# EAGLE design charger_v4 (EAGLE 9.6.1)
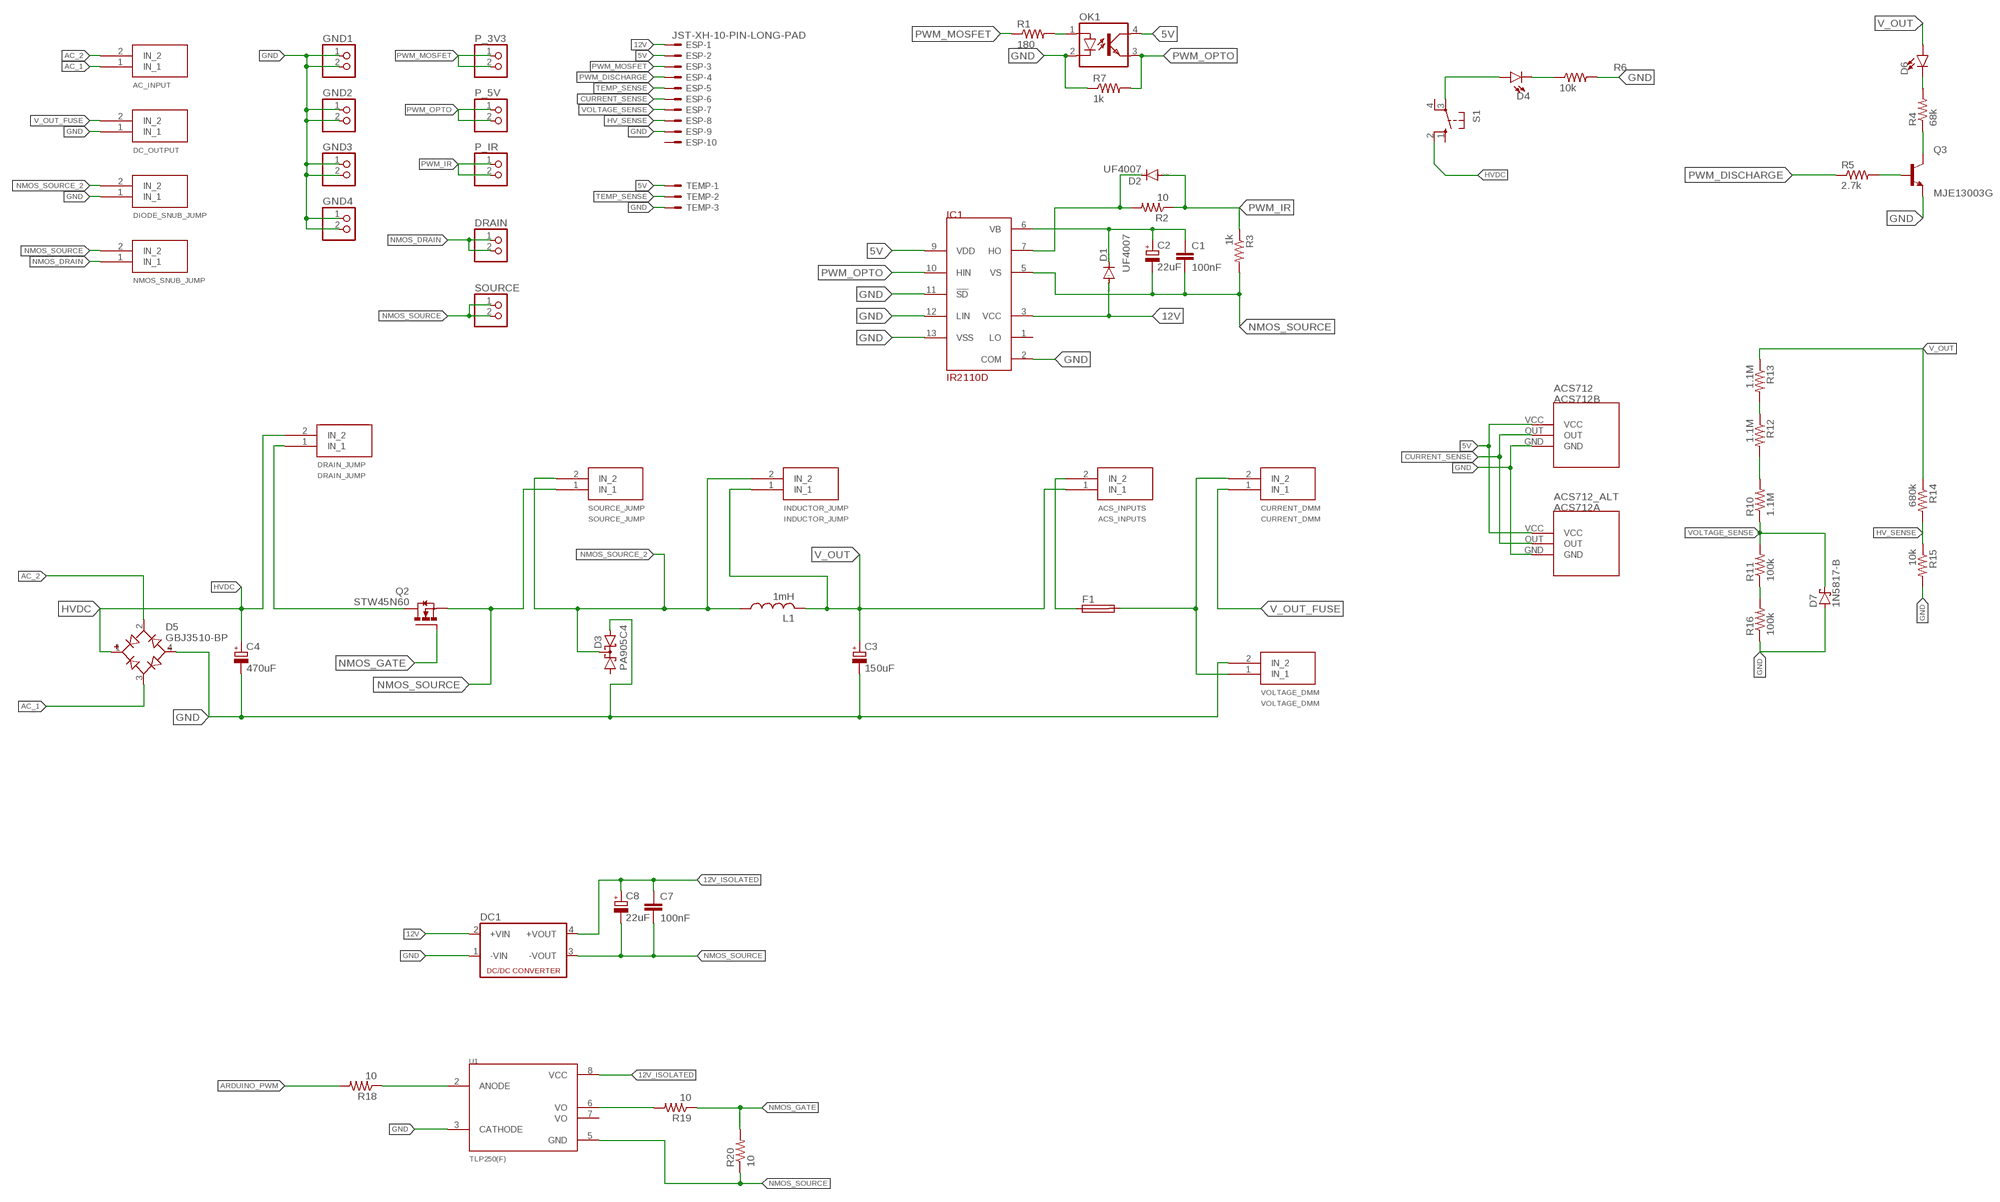
[diagram p0: schematic, sheet 1]

## Parts
AC_INPUT  AC_INPUT  TERMINAL_2P  [TERMINAL_2P]
ACS712  ACS712B  [ACS712-2]
ACS712_ALT  ACS712A  [ACS712-1]
ACS_INPUTS  ACS_INPUTS  TERMINAL_2P  [TERMINAL_2P]
C1  100nF  C-EU025-025X050  [C025-025X050]
C2  22uF  CPOL-EUE2,5-6E  [E2,5-6E]
C3  150uF  CPOL-EUE7.5-18  [E7,5-18]
C4  470uF  CPOL-EUE10-35  [EB35D]
C7  100nF  C-EU025-025X050  [C025-025X050]
C8  22uF  CPOL-EUE2,5-6E  [E2,5-6E]
CURRENT_DMM  CURRENT_DMM  TERMINAL_2P  [TERMINAL_2P]
D1  UF4007  BAS15  [DO34-7]
D2  UF4007  BAS15  [DO34-7]
D3  PA905C4  PBYR3035  [SOT93S]
D4  LED5MM  [LED_5MM]
D5  GBJ3510-BP  [DIOB_GBJ3510-BP]
D6  LED5MM  [LED_5MM]
D7  1N5817-B  [DO41-7.6]
DC1  NME  [NME]
DC_OUTPUT  DC_OUTPUT  TERMINAL_2P  [TERMINAL_2P]
DIODE_SNUB_JUMP  DIODE_SNUB_JUMP  TERMINAL_2P  [TERMINAL_2P]
DRAIN  PINHD-1X2  [1X02]
DRAIN_JUMP  DRAIN_JUMP  TERMINAL_2P  [TERMINAL_2P]
ESP  JST-XH-10-PIN-LONG-PAD  [JST-XH-10-PACKAGE-LONG-PAD]
F1  FUSEHOLDER  [FUSEHOLDER]
GND1  PINHD-1X2  [1X02]
GND2  PINHD-1X2  [1X02]
GND3  PINHD-1X2  [1X02]
GND4  PINHD-1X2  [1X02]
IC1  IR2110D  [DIL14]
INDUCTOR_JUMP  INDUCTOR_JUMP  TERMINAL_2P  [TERMINAL_2P]
L1  1mH  L-USTJ7-U1  [TJ7-U1]
NMOS_SNUB_JUMP  NMOS_SNUB_JUMP  TERMINAL_2P  [TERMINAL_2P]
OK1  SFH618A-5  [DIP4]
P_3V3  PINHD-1X2  [1X02]
P_5V  PINHD-1X2  [1X02]
P_IR  PINHD-1X2  [1X02]
Q2  STW45N60  IRFP240  [TO247AC]
Q3  MJE13003G  [TO229P780X300X1364-3]
R1  180  R-US_0204/7  [0204/7]
R2  10  R-US_0204/7  [0204/7]
R3  1k  R-US_0204/7  [0204/7]
R4  68k  R-US_0411/15  [0411/15]
R5  2.7k  R-US_0204/7  [0204/7]
R6  10k  R-US_0204/7  [0204/7]
R7  1k  R-US_0204/7  [0204/7]
R10  1.1M  R-US_R0805  [R0805]
R11  100k  R-US_R0805  [R0805]
R12  1.1M  R-US_R0805  [R0805]
R13  1.1M  R-US_R0805  [R0805]
R14  680k  R-US_0207/10  [0207/10]
R15  10k  R-US_0207/10  [0207/10]
R16  100k  R-US_R0805  [R0805]
R18  10  R-US_0204/7  [0204/7]
R19  10  R-US_0204/7  [0204/7]
R20  10  R-US_0204/7  [0204/7]
S1  10-XX  [B3F-10XX]
SOURCE  PINHD-1X2  [1X02]
SOURCE_JUMP  SOURCE_JUMP  TERMINAL_2P  [TERMINAL_2P]
TEMP  JST-XH-03-PIN-LONG-PAD  [JST-XH-03-PACKAGE-LONG-PAD]
U1  TLP250(F)  [DIP1016W50P254L966H380Q8P]
VOLTAGE_DMM  VOLTAGE_DMM  TERMINAL_2P  [TERMINAL_2P]

## Nets
5V: ACS712.VCC ACS712_ALT.VCC ESP.2 IC1.9(VDD) OK1.4(COL) TEMP.1
12V: D1.A DC1.2(+VIN) ESP.1 IC1.3(VCC)
12V_ISOLATED: C7.1 C8.+ DC1.4(+VOUT) U1.8(VCC)
AC_1: AC_INPUT.1(IN_1) D5.3(AC2)
AC_2: AC_INPUT.2(IN_2) D5.2(AC1)
ARDUINO_PWM: R18.2
CURRENT_SENSE: ACS712.OUT ACS712_ALT.OUT ESP.6
GND: ACS712.GND ACS712_ALT.GND C3.- C4.- D3.A2 D5.4(-) D7.A DC1.1(-VIN) DC_OUTPUT.1(IN_1) DIODE_SNUB_JUMP.1(IN_1) ESP.9 GND1.1 GND1.2 GND2.1 GND2.2 GND3.1 GND3.2 GND4.1 GND4.2 IC1.2(COM) IC1.11(!SD) IC1.12(LIN) IC1.13(VSS) OK1.2(C) Q3.3(E) R6.2 R7.1 R15.2 R16.1 TEMP.3 U1.3(CATHODE) VOLTAGE_DMM.2(IN_2)
HV_SENSE: ESP.8 R14.2 R15.1
HVDC: C4.+ D5.1(+) DRAIN_JUMP.2(IN_2) S1.2(S1)
N$1: D2.C IC1.7(HO) R2.2
N$2: D4.A S1.3(P)
N$3: Q3.2(C) R4.1
N$4: D6.K(C) R4.2
N$5: Q3.1(B) R5.2
N$8: D4.K(C) R6.1
N$9: OK1.1(A) R1.2
N$11: CURRENT_DMM.2(IN_2) F1.2 VOLTAGE_DMM.1(IN_1)
N$12: R10.2 R12.2
N$13: R12.1 R13.2
N$14: R11.1 R16.2
N$15: ACS_INPUTS.2(IN_2) F1.1
N$17: R18.1 U1.2(ANODE)
N$21: R19.2 U1.6(VO)
NMOS_DRAIN: DRAIN.1 DRAIN.2 DRAIN_JUMP.1(IN_1) NMOS_SNUB_JUMP.1(IN_1) Q2.2(D)
NMOS_GATE: Q2.1(G) R19.1 R20.2
NMOS_SOURCE: C1.2 C2.- C7.2 C8.- DC1.3(-VOUT) IC1.5(VS) NMOS_SNUB_JUMP.2(IN_2) Q2.3(S) R3.2 R20.1 SOURCE.1 SOURCE.2 SOURCE_JUMP.1(IN_1) U1.5(GND)
NMOS_SOURCE_2: D3.C DIODE_SNUB_JUMP.2(IN_2) INDUCTOR_JUMP.2(IN_2) L1.1 SOURCE_JUMP.2(IN_2)
PWM_DISCHARGE: ESP.4 R5.1
PWM_IR: D2.A P_IR.1 P_IR.2 R2.1 R3.1
PWM_MOSFET: ESP.3 P_3V3.1 P_3V3.2 R1.1
PWM_OPTO: IC1.10(HIN) OK1.3(EMIT) P_5V.1 P_5V.2 R7.2
TEMP_SENSE: ESP.5 TEMP.2
V_OUT: ACS_INPUTS.1(IN_1) C3.+ D6.A INDUCTOR_JUMP.1(IN_1) L1.2 R13.1 R14.1
V_OUT_FUSE: CURRENT_DMM.1(IN_1) DC_OUTPUT.2(IN_2)
VB: C1.1 C2.+ D1.C IC1.6(VB)
VOLTAGE_SENSE: D7.C ESP.7 R10.1 R11.2
Unconnected: D3.A1 ESP.10 IC1.1(LO) S1.1(S) S1.4(P1) U1.7(VO)

## Library data of the parts
AC_INPUT ACS_INPUTS CURRENT_DMM DC_OUTPUT DIODE_SNUB_JUMP DRAIN_JUMP INDUCTOR_JUMP NMOS_SNUB_JUMP SOURCE_JUMP VOLTAGE_DMM = TA_library:TERMINAL_2P
ACS712 ACS712_ALT = TA_library:ACS712
C1 C7 = rcl:C-EU: CAPACITOR, European symbol; SPICEPREFIX: C
C2-C4 C8 = rcl:CPOL-EU: POLARIZED CAPACITOR, European symbol; SPICEPREFIX: C
D1 D2 = diode:BAS15: DIODE high speed
D3 = diode:PBYR3035: Dual DIODE common cathode
D4 D6 = Sparkfun_LED:LED: LED (Generic) Standard schematic elements and footprints for 5mm, 3mm, 1206, and 0603 sized LEDs. Generic LEDs with no color specified.
D5 = GBJ3510-BP:GBJ3510-BP: Diode Rectifier Bridge Single 1KV 35A 4-Pin(4+Tab) Case GBJ Bulk/Tube Check availability <https://pricing.snapeda.com/parts/GBJ3510-BP/Micro%20Commercial/view-part?ref=eda>; AVAILABILITY: In Stock; DESCRIPTION: Bridge Rectifier Single Phase Standard 1 kV Through Hole GBJ; MF: Micro Commercial; MP: GBJ3510-BP; PACKAGE: SIP-4 Micro Commercial Co; PRICE: None; PURCHASE-URL: https://pricing.snapeda.com/search/part/GBJ3510-BP/?ref=eda
D7 = diode:1N581*: 1.0A SCHOTTKY BARRIER RECTIFIER Source: http://www.diodes.com/datasheets/ds23001.pdf
DC1 = dc-dc-converter:NME: DC-DC CONVERTER; MF: C & D TECHNOLOGIES, INC; MPN: NME1205D; OC_FARNELL: 1021466; OC_NEWARK: 98B8198
DRAIN GND1-GND4 P_3V3 P_5V P_IR SOURCE = pinhead:PINHD-1X2: PIN HEADER
ESP = Rembrandt Electronics - JST XH Connectors v1-0:JST-XH-10-PIN: JST XH Connector 2 Pin Wire to board connector. Pitch: 2,54 mm, (0.100") Number of pins: 10 Created by Rembrandt Electronics www.rembrandtelectronics.com
F1 = TA_library:FUSEHOLDER: FUSE HOLDER grid 22,5mm, isolated cap OGN0031 8201, Schurter (Buerklin); MPN: 0031.7701.11; OC_FARNELL: unknown; OC_NEWARK: 04F1224
IC1 = irs:IR2110
L1 = custom_inductor:L-US: INDUCTOR, American symbol; SPICEPREFIX: L
OK1 = optocoupler:SFH618?*: Optocoupler, Phototransistor Output, Low Input Current Source: Data sheet <http://www.vishay.com/docs/83673/sfh618.pdf>; MF: VISHAY/TELEFUNKEN; MPN: SFH618A-5; OC_FARNELL: 1469593; OC_NEWARK: 59K0259
Q2 = IRFP240(TO-247):IRFP240: MOSFET N-CH 200V 20A TO-247AC Check availability <https://pricing.snapeda.com/parts/IRFP240/Vishay%20Siliconix/view-part?ref=eda>; AVAILABILITY: In Stock; DESCRIPTION: N-Channel 200 V 20A (Tc) 150W (Tc) Through Hole TO-247AC; MF: Vishay Siliconix; MP: IRFP240; PACKAGE: TO-247 Vishay Siliconix; PRICE: None
Q3 = MJE13003G:MJE13003G: Bipolar (BJT) Transistor NPN 400V 1.5A 10MHz 1.4W Through Hole TO-225AA Check availability <https://pricing.snapeda.com/parts/MJE13003G/ON%20Semiconductor/view-part?ref=eda>; AVAILABILITY: Not in stock; DESCRIPTION: Bipolar (BJT) Transistor NPN 400 V 1.5 A 10MHz 1.4 W Through Hole TO-126; MF: ON Semiconductor; MP: MJE13003G; PACKAGE: TO-126 ON Semiconductor; PRICE: None
R1-R7 R10-R16 R18-R20 = rcl:R-US_: RESISTOR, American symbol; SPICEPREFIX: R
S1 = switch-omron:10-XX: OMRON SWITCH; MPN: B3F-1000; OC_FARNELL: 176432; OC_NEWARK: 36M3542
TEMP = JST XH Connectors v1-0:JST-XH-03-PIN: JST XH Connector 2 Pin Wire to board connector. Pitch: 2,54 mm, (0.100") Number of pins: 3 Created by Rembrandt Electronics www.rembrandtelectronics.com
U1 = TLP250_F_:TLP250(F): Optocoupler; THT; Out: IGBT driver; 2.5kV; DIP8; 1.5A Check availability <https://pricing.snapeda.com/parts/TLP250%28F%29/Toshiba/view-part?ref=eda>; AVAILABILITY: In Stock; DESCRIPTION: 1.5A Gate Driver Optical Coupling 2500Vrms 1 Channel 8-DIP; MF: Toshiba; MP: TLP250(F); PACKAGE: DIP-8 Toshiba; PRICE: None; PURCHASE-URL: https://pricing.snapeda.com/search/part/TLP250(F)/?ref=eda

## Net classes
0 default: width 0.305 mm
1 power: width 6.985 mm, clearance 0.508 mm to class 0
2 pwm_12: width 0.305 mm, clearance 0.508 mm to class 0, clearance 0.508 mm to class 1

## Board
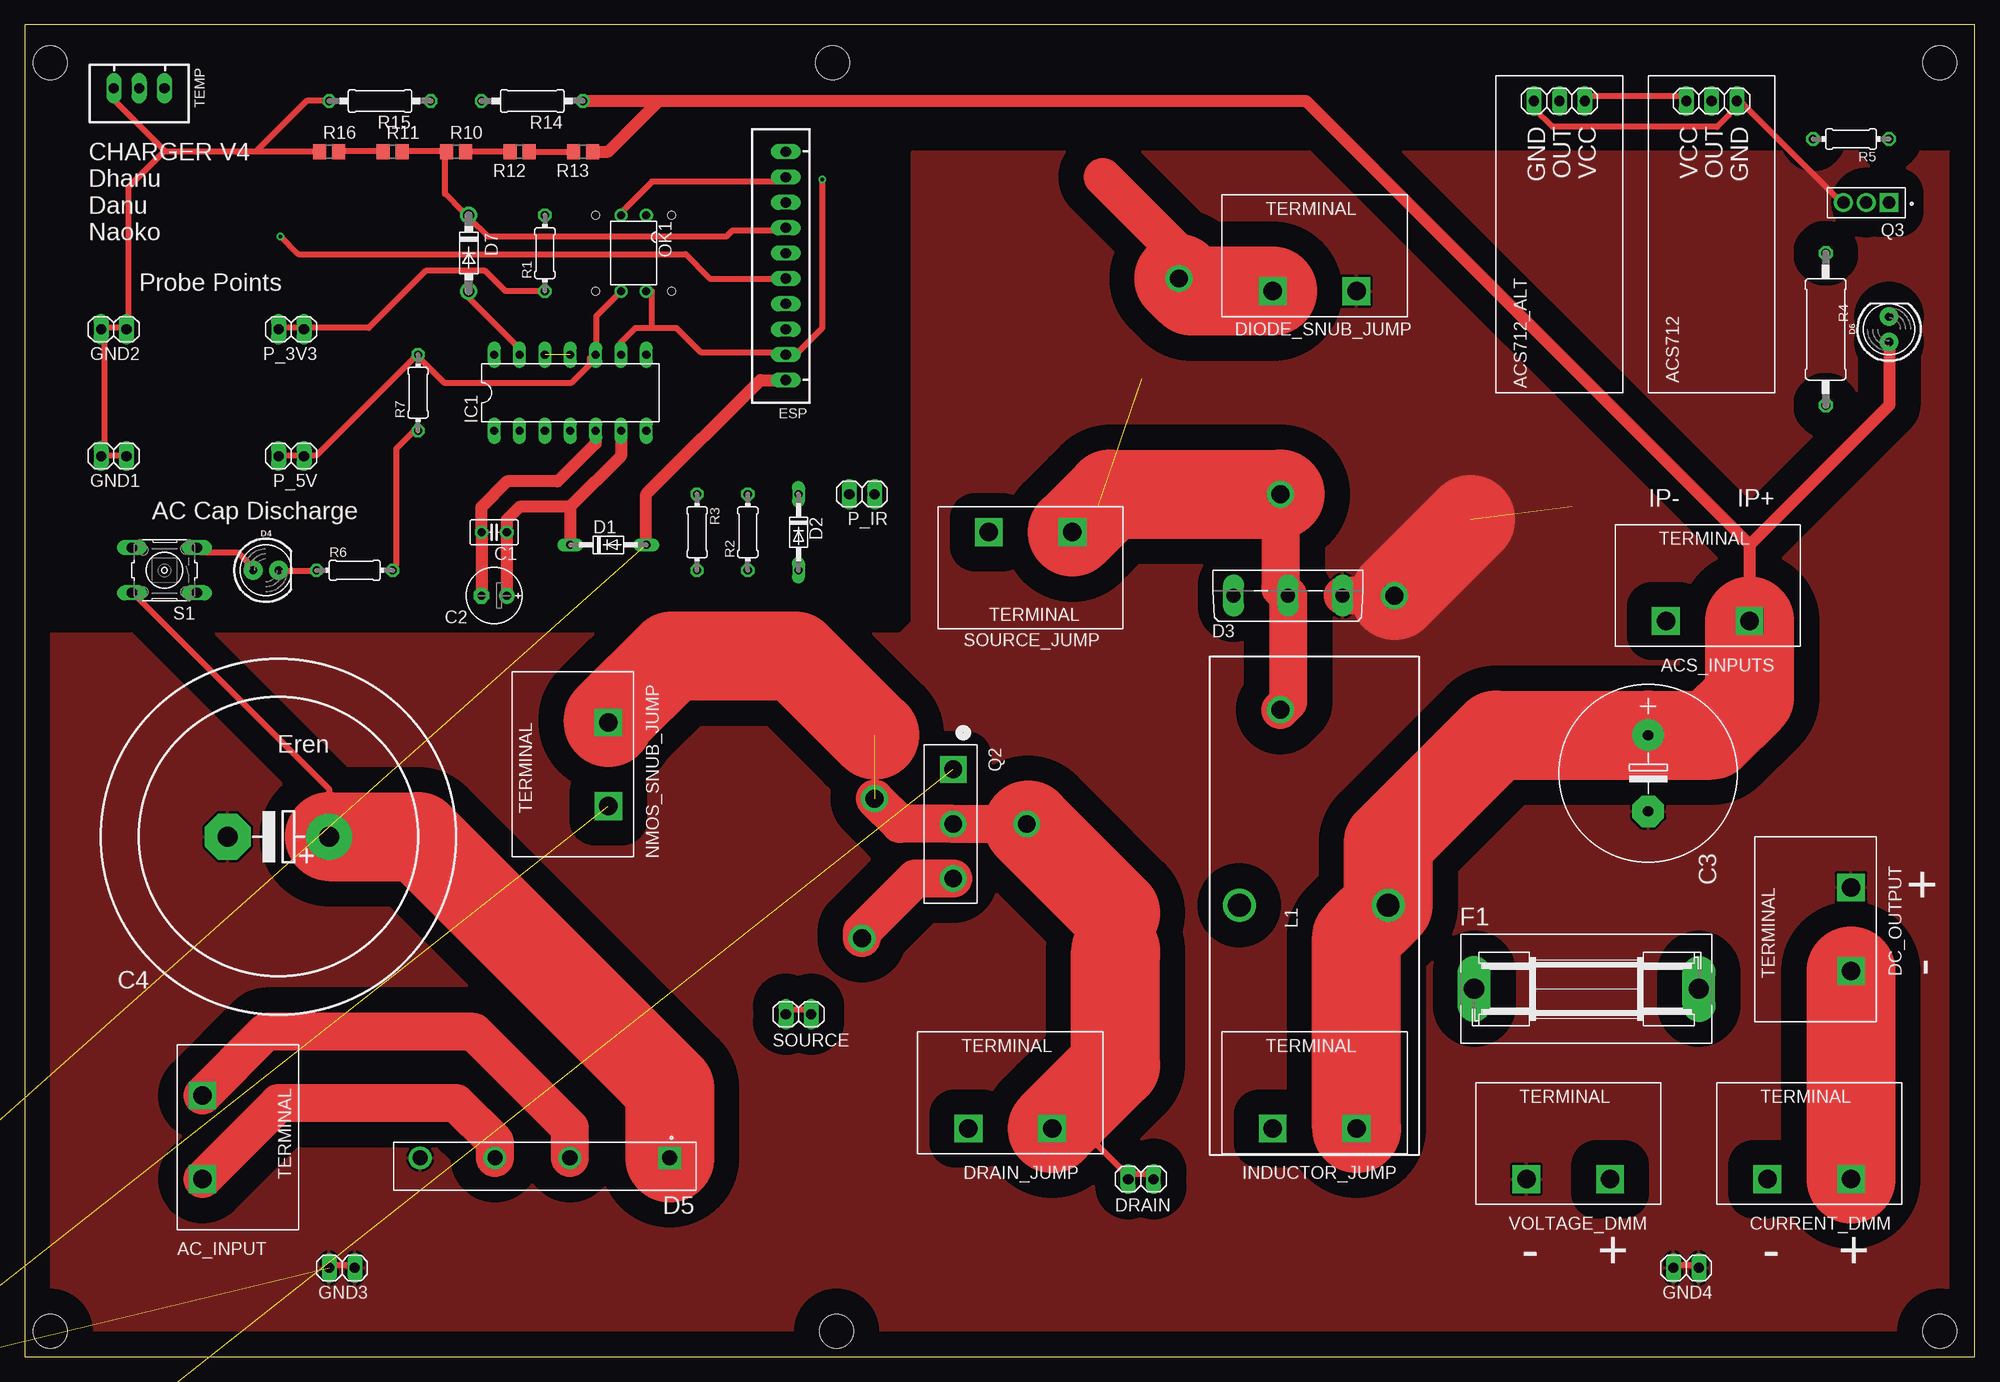
[diagram p1: board, top side]
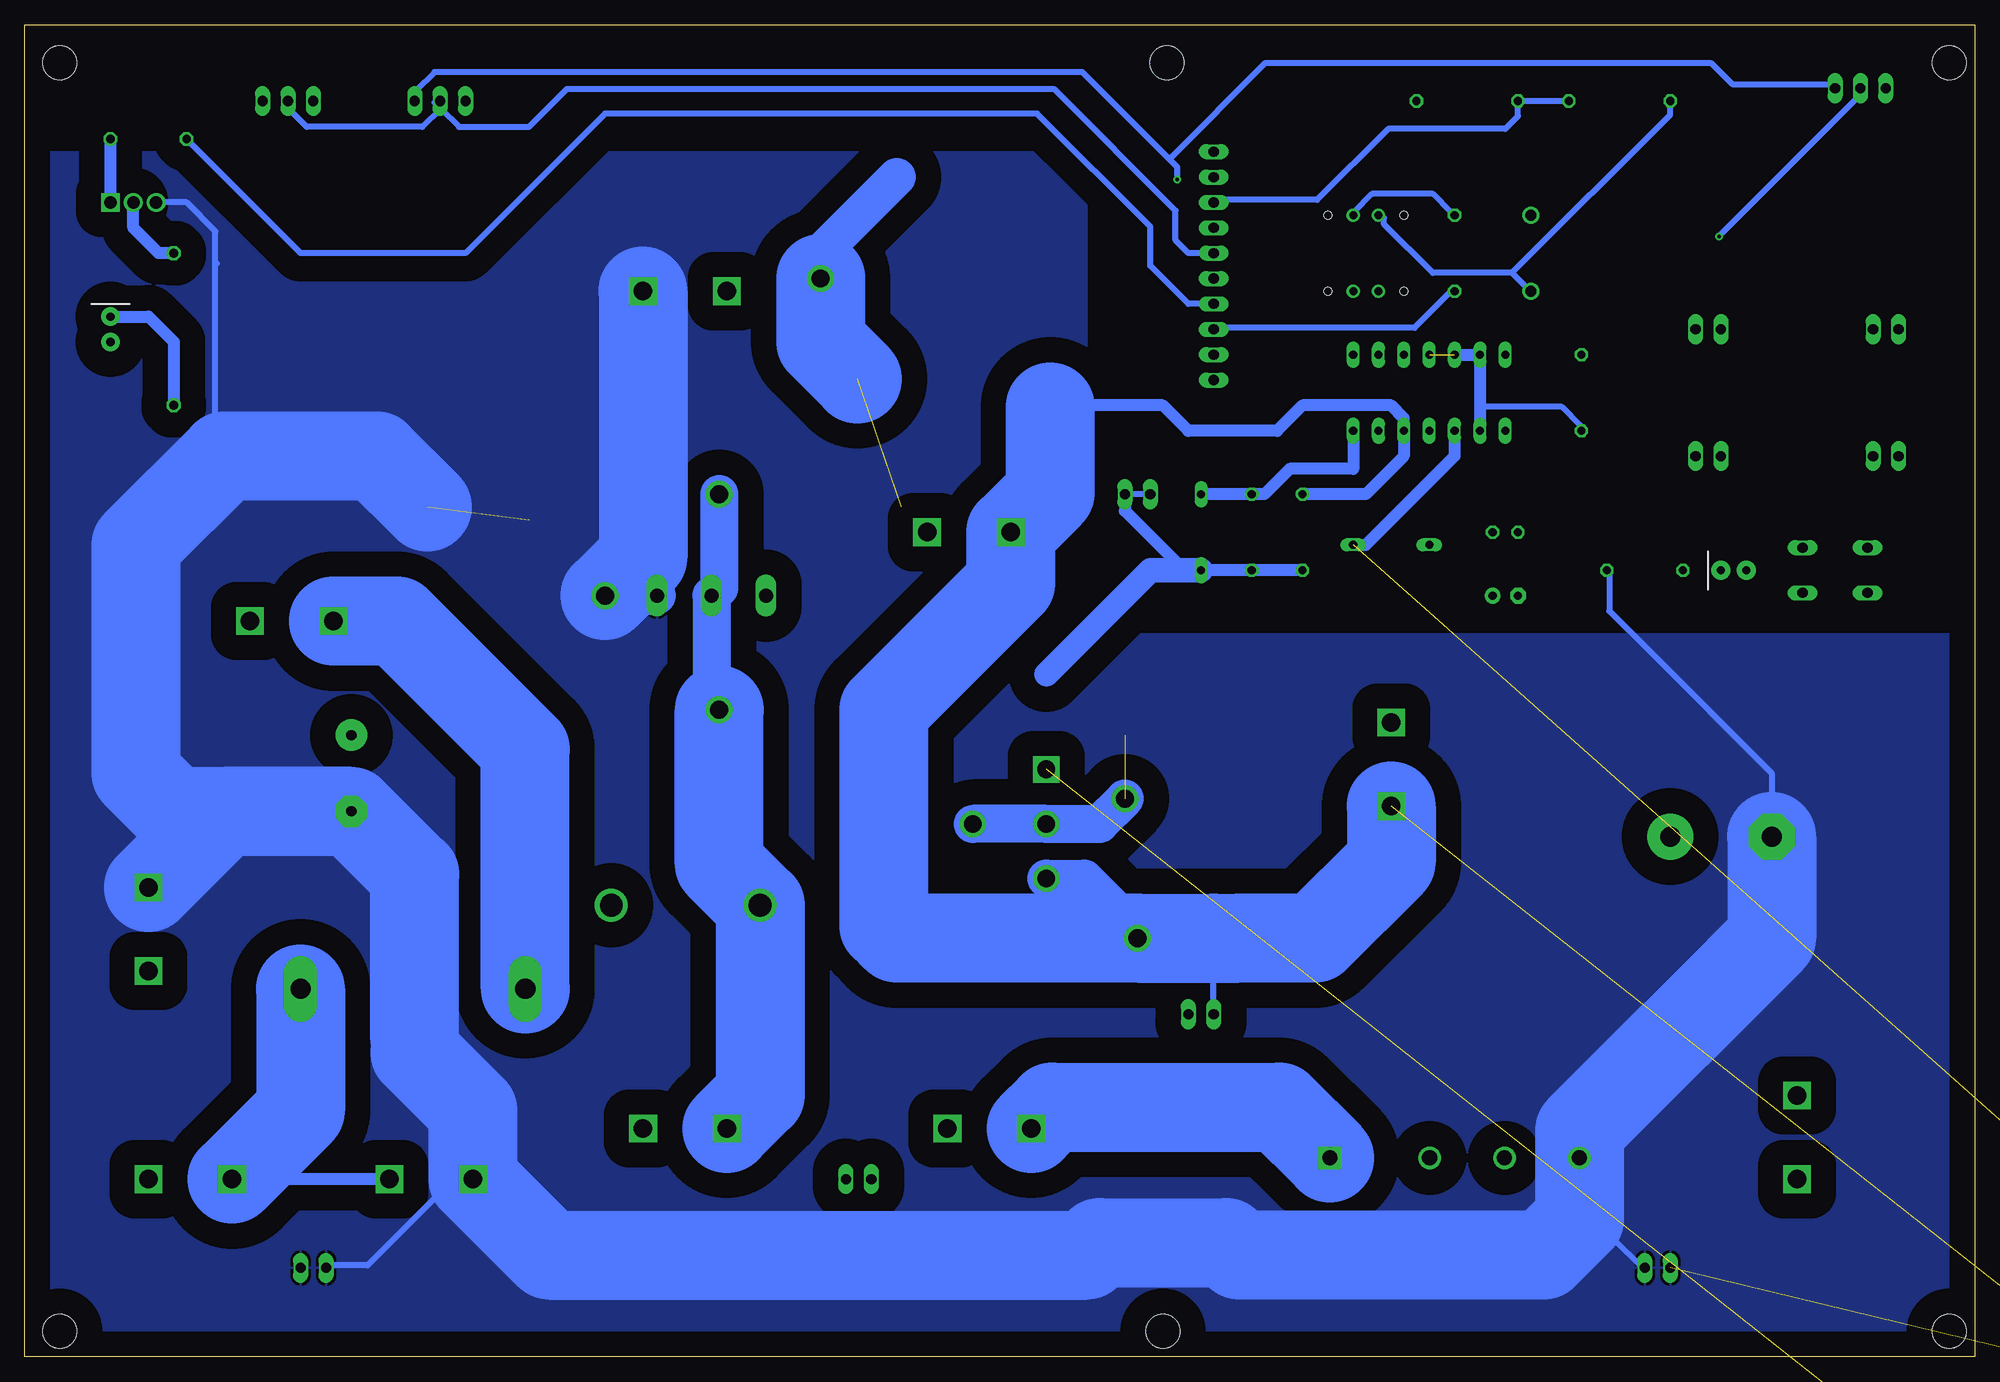
[diagram p2: board, bottom side, seen from below]

Size 195.25 x 133.34 mm. Coordinates in mm from the lower left corner, seen from the top.
Outline: 0,0 195.25,0 195.25,133.34 0,133.34 0,0
Copper layers (1*16): Top 0.035mm / dielectric 1.5mm / Bottom 0.035mm
Design rules "default *": minimum track width 24mil, minimum drill 0.35mm, track to track 24mil, track to pad 24mil, pad to pad 12mil, via to via 24mil, smd to smd 12mil, copper to edge 40mil, drill to drill 6mil, minimum pad ring 10mil, minimum via ring 8mil, stop-mask expansion 4mil, vias tented up to drill 0mil, thermal gap 10mil
Holes 3.4 mm at 2.54,129.54 81.28,2.54 2.54,2.54 80.9,129.54 191.77,2.54 191.77,129.54
Holes 0.8 mm at 57.15,114.3 57.15,106.68 64.77,114.3 64.77,106.68

### Footprints (pad centres in the part's own frame; a part is rotated, then mirrored left to right if it is on the bottom)
TERMINAL_2P = drill 1.854 square: 1 0,-3.81; 2 0,4.572
ACS712-2 = drill 1.016 long: GND -2.54,0; OUT 0,0; VCC 2.54,0
ACS712-1 = drill 1.016 long: GND 2.54,0; OUT 0,0; VCC -2.54,0
C025-025X050 = drill 0.813 octagon: 1 -1.27,0; 2 1.27,0
E2,5-6E = drill 0.813 pad 1.575: + -1.27,0 | drill 0.813 pad 1.575 octagon: - 1.27,0
E7,5-18 = drill 1.016 pad 3.15: + -3.81,0 | drill 1.016 pad 3.15 octagon: - 3.81,0
EB35D = drill 2.007 pad 4.597: + -5.08,0 | drill 2.007 pad 4.597 octagon: - 5.08,0
DO34-7 = drill 0.813 long: A 3.81,0; C -3.81,0
SOT93S = drill 1.397 long: A1 -5.461,-2.54; A2 5.461,-2.54; C 0,-2.54
LED_5MM = drill 0.813 pad 1.88: A -1.27,0; K 1.27,0
DIOB_GBJ3510-BP = drill 1.51 pad 2.27 square: 1 -12.5,-0.85 | drill 1.51 pad 2.27: 2 -2.5,-0.85; 3 5,-0.85; 4 12.5,-0.85
DO41-7.6 = drill 1.1 pad 1.7: A 3.81,0; C -3.81,0
NME = drill 0.813 long: 1 0,3.81; 2 0,1.27; 3 0,-1.27; 4 0,-3.81
1X02 = drill 1.016 long: 1 -1.27,0; 2 1.27,0
JST-XH-10-PACKAGE-LONG-PAD = drill 1.016 long: 1 -11.43,0; 2 -8.89,0; 3 -6.35,0; 4 -3.81,0; 5 -1.27,0; 6 1.27,0; 7 3.81,0; 8 6.35,0; 9 8.89,0; 10 11.43,0
FUSEHOLDER = drill 2.007 pad 3.302 long: 1 -11.252,0; 2 11.252,0
DIL14 = drill 0.813 long: 1 -7.62,-3.81; 2 -5.08,-3.81; 3 -2.54,-3.81; 4 0,-3.81; 5 2.54,-3.81; 6 5.08,-3.81; 7 7.62,-3.81; 8 7.62,3.81; 9 5.08,3.81; 10 2.54,3.81; 11 0,3.81; 12 -2.54,3.81; 13 -5.08,3.81; 14 -7.62,3.81
TJ7-U1 = drill 2.286: 1 -6.503,4.826; 2 8.408,4.826
DIP4 = drill 0.8: 1 -1.27,-3.81; 2 1.27,-3.81; 3 1.27,3.81; 4 -1.27,3.81
TO247AC = drill 1.79 pad 2.69 square: 1 -5.46,0.255 | drill 1.79 pad 2.69: 2 0,0.255; 3 5.46,0.255
TO229P780X300X1364-3 = drill 1.25 square: 1 0,0 | drill 1.25: 2 2.29,0; 3 4.58,0
0204/7 = drill 0.813 octagon: 1 -3.81,0; 2 3.81,0
0411/15 = drill 0.914 octagon: 1 -7.62,0; 2 7.62,0
R0805 = smd 1.3 x 1.5: 1 -0.95,0; 2 0.95,0
0207/10 = drill 0.813 octagon: 1 -5.08,0; 2 5.08,0
B3F-10XX = drill 1.016 long: 1 -3.251,2.261; 2 3.251,2.261; 3 -3.251,-2.261; 4 3.251,-2.261
JST-XH-03-PACKAGE-LONG-PAD = drill 1.016 long: 1 -2.54,0; 2 0,0; 3 2.54,0
DIP1016W50P254L966H380Q8P = drill 0.9 pad 1.5 square: 1 -5.08,3.81 | drill 0.9 pad 1.5: 2 -5.08,1.27; 3 -5.08,-1.27; 4 -5.08,-3.81; 5 5.08,-3.81; 6 5.08,-1.27; 7 5.08,1.27; 8 5.08,3.81

### Placement (x,y rotation side)
AC_INPUT  17.78,21.59 0 top
ACS712  168.91,125.73 180 top
ACS712_ALT  153.67,125.73 180 top
ACS_INPUTS  168.91,73.66 90 top
C1  46.99,82.55 180 top
C2  46.99,76.2 180 top
C3  162.56,58.42 270 top
C4  25.4,52.07 180 top
C7  -39.37,-21.59 0 top  (outside the outline)
C8  -39.37,-29.21 0 top  (outside the outline)
CURRENT_DMM  179.07,17.78 90 top
D1  58.42,81.28 0 top
D2  77.47,82.55 270 top
D3  126.49,78.74 0 top
D4  24.13,78.74 0 top
D5  52.07,19.05 180 top
D6  186.69,102.87 90 top
D7  44.45,110.49 270 top
DC1  -40.64,-11.43 0 top  (outside the outline)
DC_OUTPUT  182.88,43.18 180 top
DIODE_SNUB_JUMP  129.54,106.68 90 top
DRAIN  111.76,17.78 0 top
DRAIN_JUMP  99.06,22.86 90 top
ESP  76.2,109.22 90 top
F1  156.39,36.83 0 top
GND1  8.89,90.17 180 top
GND2  8.89,102.87 180 top
GND3  31.75,8.89 180 top
GND4  166.37,8.89 180 top
IC1  54.61,96.52 0 top
INDUCTOR_JUMP  129.54,22.86 90 top
L1  128.12,40.39 0 top
NMOS_SNUB_JUMP  58.42,59.69 180 top
OK1  60.96,110.49 180 top
P_3V3  26.67,102.87 180 top
P_5V  26.67,90.17 180 top
P_IR  83.82,86.36 180 top
Q2  92.71,53.34 270 top
Q3  186.69,115.57 180 top
R1  52.07,110.49 90 top
R2  72.39,82.55 90 top
R3  67.31,82.55 90 top
R4  180.34,102.87 270 top
R5  182.88,121.92 0 top
R6  33.02,78.74 0 top
R7  39.37,96.52 90 top
R10  43.18,120.65 0 top
R11  36.83,120.65 0 top
R12  49.53,120.65 180 top
R13  55.88,120.65 180 top
R14  50.8,125.73 180 top
R15  35.56,125.73 180 top
R16  30.48,120.65 0 top
R18  -29.21,-16.51 0 top  (outside the outline)
R19  -36.83,-35.56 0 top  (outside the outline)
R20  -36.83,-40.64 0 top  (outside the outline)
S1  13.97,78.74 180 top
SOURCE  77.47,34.29 180 top
SOURCE_JUMP  100.33,82.55 270 top
TEMP  11.43,127 180 top
U1  -27.94,-5.08 0 top  (outside the outline)
VOLTAGE_DMM  154.94,17.78 90 top

### Tracks (layer width: path | path; a pad name or v marks a point on that pad's centre or on a via)
5V  (via drill 0.35)
  Top 0.61: ACS712_ALT.VCC 156.67,126.19 165.81,126.19 ACS712.VCC | 62.79,103.02 62.79,106.68 OK1.4 | IC1.9 59.69,101.56 61.15,103.02 62.79,103.02 | 76.2,100.58 67.67,100.58 65.23,103.02 62.79,103.02 | v79.86,117.86 79.86,103.02 77.42,100.58 76.2,100.58 | 76.2,100.58 ESP.2
  Bottom 0.61: 80.64,119.91 89.36,128.63 154.23,128.63 156.06,126.8 156.06,126.19 ACS712_ALT.VCC | 80.64,119.91 79.86,119.13 v79.86,117.86 | 80.64,119.91 71.02,129.54 26.42,129.54 24.28,127.41 14.02,127.41 TEMP.1
12V  (1 unrouted)
  Top 1.219: D1.A 62.23,86.36 73.66,97.79 ESP.1
  Bottom 1.219: IC1.3 52.07,90.17 60.96,81.28 D1.A
12V_ISOLATED  (3 unrouted)
AC_1
  Top 3.81: D5.3 47.07,21.51 43.18,25.4 25.4,25.4 AC_INPUT.1
AC_2
  Top 3.81: AC_INPUT.2 24.13,32.51 44.96,32.51 54.57,22.9 D5.2
CURRENT_SENSE
  Bottom 0.61: 153.62,124.97 154.23,125.58 ACS712_ALT.OUT 153.62,124.97 | 153.62,124.97 151.79,123.14 144.78,123.14 140.97,126.95 92.2,126.95 80.01,114.76 80.01,111.76 78.74,110.49 ESP.6 | 153.62,124.97 155.45,123.14 167.03,123.14 168.86,124.97 168.86,125.58 ACS712.OUT
GND  (via drill 1.79)  (4 unrouted)
  Top 0.61: R15.2 28.19,125.73 23.11,120.65 R16.1 14.07,120.65 | OK1.2 59.74,114.61 62.79,117.65 76.2,117.65 ESP.9 | IC1.13 49.53,100.94 44.45,106.02 D7.A | R6.2 37.19,79.3 37.19,90.93 38.91,92.66 R7.1 | 171.91,125.58 169.47,123.14 153.01,123.14 151.18,124.97 151.18,125.58 ACS712_ALT.GND | 171.91,125.58 181.66,115.82 Q3.3 | 171.91,125.58 ACS712.GND | GND4.2 165.2,9.14 167.64,9.14 GND4.1 | GND3.2 30.48,9.14 32.92,9.14 GND3.1 | 7.92,90.22 9.75,90.22 GND1.1 | 7.92,90.22 7.92,102.41 GND2.2 7.92,103.02 9.75,103.02 GND2.1 10.36,103.02 10.36,117.09 13.92,120.65 14.07,120.65 | 7.92,90.22 GND1.2 | 14.07,120.65 9.14,125.58 9.14,126.8 TEMP.3
  Top 3.81: v137.16,76.2 D3.A2
  Top 8.89: 144.78,83.82 v137.16,76.2
  Bottom 0.61: 49.53,95.1 41.35,95.1 39.52,93.27 R7.1 | 46.33,108.51 54.25,108.51 59.13,113.39 59.13,114 OK1.2 | 46.33,108.51 44.5,106.68 D7.A | R15.2 30.48,124.36 46.33,108.51 | GND3.1 33.53,9.14 35.97,11.58 39.57,13.77 | GND4.2 164.59,9.14 160.93,9.14 154.23,15.85 VOLTAGE_DMM.2 | 176.17,109.6 176.17,94.49 175.26,90.17 | 176.17,109.6 176.01,109.47 | R6.2 36.58,78.69 36.58,74.68 20.32,58.42 C4.- 20.32,56.16 | 176.17,109.6 176.17,112.67 179.07,115.57 Q3.3
  Bottom 1.219: IC1.12 IC1.13 49.53,95.1 IC1.2 | 156.21,30.48 156.21,31.75
  Bottom 3.81: v137.16,76.2 D3.A2
  Bottom 8.89: C4.- 20.32,41.91 39.57,22.66 D5.4 39.57,13.77 43.18,10.16 73.66,10.16 74.93,11.43 87.63,11.43 88.9,10.16 142.75,10.16 VOLTAGE_DMM.2 150.37,24.64 156.21,30.48 | v137.16,76.2 133.35,80.01 DIODE_SNUB_JUMP.1 | C3.- 175.26,54.61 DC_OUTPUT.1 | C3.- 156.21,48.26 156.21,31.75 | 154.94,85.09 160.02,90.17 175.26,90.17 184.15,81.28 184.15,58.42 180.34,54.61 C3.-
  pour Top (isolate 2.54): -16.51,72.39 87.63,72.39 88.9,73.66 88.9,120.65 214.63,120.65 215.9,119.38 215.9,-8.89 -13.97,-8.89 -16.51,-6.35
  pour Bottom (isolate 2.54): -17.78,72.39 88.9,72.39 88.9,120.65 218.44,120.65 220.98,118.11 220.98,-8.89 217.17,-12.7 -21.59,-12.7 -21.59,68.58
HV_SENSE
  Bottom 0.61: R15.1 R14.2 45.72,124.21 46.99,122.94 58.73,122.94 65.84,115.82 76.2,115.82 ESP.8
HVDC
  Top 0.61: S1.2 10.79,76.48 30.48,56.79 C4.+
  Top 8.89: C4.+ 39.37,52.07 64.57,26.87 D5.1
  Bottom 8.89: D5.1 69.65,24.98 92.37,24.98 DRAIN_JUMP.2
N$1
  Bottom 1.219: D2.C R2.2 71.12,86.36 68.58,88.9 62.23,88.9 IC1.7
N$2
  Top 0.61: S1.3 17.68,80.52 21.34,80.52 22.55,79.3 D4.A
N$3
  Bottom 1.219: R4.1 181.86,110.49 184.4,113.03 Q3.2
N$4
  Bottom 1.219: D6.K 182.88,104.14 180.34,101.6 R4.2
N$5
  Bottom 1.219: R5.2 Q3.1
N$8
  Top 0.61: R6.1 28.65,78.69 25.6,78.69 D4.K
N$9
  Bottom 0.61: OK1.1 62.18,114.61 60.35,116.43 54.25,116.43 52.43,114.61 R1.2
N$11
  Bottom 1.219: VOLTAGE_DMM.1 CURRENT_DMM.2
  Bottom 8.89: F1.2 167.64,24.64 CURRENT_DMM.2
N$12
  Top 0.61: R10.2 44.5,120.7 48.53,120.7 R12.2
N$13
  Top 0.61: R12.1 R13.2
N$14
  Top 0.61: R16.2 31.7,120.7 35.36,120.7 R11.1
N$15
  Bottom 8.89: F1.1 145.14,60.81 157.99,73.66 ACS_INPUTS.2
N$17  (1 unrouted)
N$21  (1 unrouted)
NMOS_DRAIN  (via drill 1.79)  (1 unrouted)
  Top 0.61: DRAIN.2 112.78,18.29 110.95,18.29 DRAIN.1 110.34,18.29 104.32,24.31 | 109.22,40.23 109.12,40.23 109.22,44.45
  Top 2.54: 100.58,53.34 100.46,53.21
  Top 3.81: 100.58,53.34 v100.33,53.34 Q2.2 87.63,53.34 v85.09,55.88
  Top 8.89: 109.22,44.45 100.46,53.21 | DRAIN_JUMP.1 104.32,24.31 109.22,29.21 109.22,40.23 109.22,40.64 | 85.09,62.23 77.17,70.16 64.77,70.16 58.42,63.8 NMOS_SNUB_JUMP.1
  Bottom 3.81: v100.33,53.34 Q2.2 87.63,53.34 v85.09,55.88
NMOS_GATE  (2 unrouted)
NMOS_SOURCE  (via drill 1.79)  (5 unrouted)
  Top 0.61: SOURCE.2 76.2,34.75 78.64,34.75 SOURCE.1
  Top 1.219: IC1.5 57.15,91.44 53.34,87.63 48.26,87.63 45.72,85.09 C1.2 C2.-
  Top 3.81: Q2.3 89.16,47.88 83.82,42.55 v83.82,41.91
  Bottom 0.61: SOURCE.2 76.2,41.91 | 57.2,93.27 IC1.5
  Bottom 1.219: R3.2 60.96,86.36 57.15,90.17 IC1.5 57.15,93.98 58.42,95.25 67.31,95.25 69.85,92.71 78.74,92.71 81.28,95.25 92.41,95.25 92.56,95.1
  Bottom 3.81: Q2.3 89.16,47.88 83.82,42.55 v83.82,41.91
  Bottom 8.89: 92.56,95.1 92.56,86.51 SOURCE_JUMP.1 96.52,77.47 109.22,64.77 109.22,43.18 107.95,41.91 v83.82,41.91 76.2,41.91 73.66,41.91 66.04,41.91 58.42,49.53 NMOS_SNUB_JUMP.2
NMOS_SOURCE_2  (via drill 1.79)  (1 unrouted)
  Top 3.81: 107.95,118.11 115.57,110.49 v115.57,107.95 | v125.73,64.77 126.49,65.53 D3.C 125.73,76.96 v125.73,86.36
  Top 8.89: 107.47,85.12 SOURCE_JUMP.2 108.71,86.36 v125.73,86.36 | v115.57,107.95 116.84,106.68 DIODE_SNUB_JUMP.2
  Bottom 3.81: 107.95,118.11 115.57,110.49 v115.57,107.95 | v125.73,86.36 125.73,76.96 D3.C 126.49,65.53 v125.73,64.77
  Bottom 8.89: v115.57,107.95 115.57,101.6 111.89,97.92 | v125.73,64.77 125.73,49.33 L1.1 121.61,26.21 INDUCTOR_JUMP.2
PWM_DISCHARGE
  Bottom 0.61: ESP.4 78.74,105.41 82.55,109.22 82.55,113.13 93.88,124.46 137.16,124.46 151.13,110.49 167.64,110.49 R5.1
PWM_IR
  Bottom 0.61: R2.1 72.44,78.64 72.44,78.74 | P_IR.2 P_IR.1
  Bottom 1.219: R3.1 R2.1 72.44,78.74 D2.A | P_IR.1 85.09,84.68 79.15,78.74
  Bottom 2.438: D2.A 79.15,78.74 82.55,78.74 92.97,68.33
PWM_MOSFET
  Top 0.61: P_3V3.2 25.6,103.02 27.43,103.02 P_3V3.1 28.04,103.02 34.44,103.02 40.13,108.71 46.1,108.71 48.13,106.68 R1.1
  Bottom 0.61: ESP.3 76.2,103.02 56.08,103.02 52.43,106.68 R1.1
PWM_OPTO
  Top 0.61: OK1.3 57.2,104.19 57.2,100.58 IC1.10 56.59,99.97 56.59,99.36 54.76,97.54 41.96,97.54 39.52,99.97 R7.2 38.91,99.97 29.16,90.22 28.04,90.22 P_5V.1 27.43,90.22 25.6,90.22 P_5V.2
TEMP_SENSE  (via drill 0.35)
  Top 0.61: v25.6,112.17 27.38,110.39 66.14,110.39 68.58,107.95 ESP.5
  Bottom 0.61: v25.6,112.17 10.97,126.8 TEMP.2
V_OUT
  Top 1.219: 172.72,81.28 128.27,125.73 63.5,125.73 | ACS_INPUTS.1 172.72,81.28 | R13.1 58.42,120.65 63.5,125.73 | D6.A 186.69,95.25 172.72,81.28 | R14.1 63.5,125.73
  Top 8.89: INDUCTOR_JUMP.1 133.35,42.04 L1.2 136.53,51.44 147.32,62.23 C3.+ 168.91,62.23 172.72,66.04 ACS_INPUTS.1
V_OUT_FUSE
  Top 8.89: DC_OUTPUT.2 CURRENT_DMM.1
VB
  Top 1.219: IC1.6 59.69,90.17 54.61,85.09 | 54.61,85.09 49.53,85.09 48.26,83.82 C1.1 C2.+ | 54.61,85.09 D1.C
VOLTAGE_SENSE
  Top 0.61: R11.2 37.8,120.7 42.06,120.7 R10.1 42.06,120.09 42.06,116.43 43.89,114.61 D7.C 44.5,114 46.33,112.17 70.26,112.17 70.87,112.78 76.2,112.78 ESP.7

### Text on the board
tPlace: IP- | IP+ | + | - | - | + | - | +
tNames: CHARGER V4 / Dhanu / Danu / Naoko | Probe Points | AC Cap Discharge | Eren